# EAGLE design electret-mic-precision-rectifier (EAGLE 6.5.0)
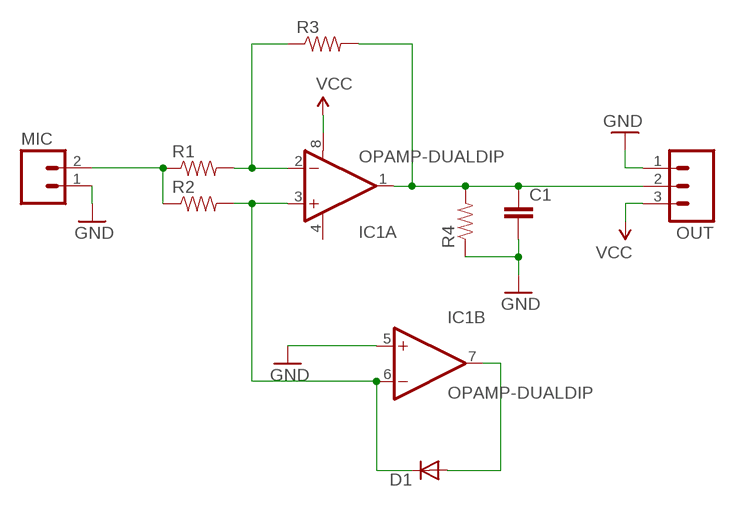
[diagram p0: schematic, sheet 1]

## Parts
C1  CAP_  [AXIAL-5MM]
D1  DIODEPTH  [DIODE-1N4001]
IC1  OPAMP-DUALDIP  [DIP08]
MIC  M02PTH  [1X02]
OUT  M03PTH  [1X03]
R1  RESISTORPTH-1/6W  [1/6W-RES]
R2  RESISTORPTH-1/6W  [1/6W-RES]
R3  RESISTORPTH-1/6W  [1/6W-RES]
R4  RESISTORPTH-1/6W  [1/6W-RES]

## Nets
GND: C1.P$2 IC1.5(B:+IN) MIC.1 OUT.1 R4.1
N$1: C1.P$1 IC1.1(A:OUT) OUT.2 R3.2 R4.2
N$2: IC1.2(A:-IN) R1.2 R3.1
N$4: D1.C IC1.3(A:+IN) IC1.6(B:-IN) R2.2
N$5: D1.A IC1.7(B:OUT)
N$6: MIC.2 R1.1 R2.1
VCC: IC1.8(A:V+) OUT.3

## Power pins joined to a net without a drawn wire
V-: IC1.4(A:V-)

## Library data of the parts
C1 = SparkFun-Capacitors:CAP: Capacitor Standard 0603 ceramic capacitor, and 0.1" leaded capacitor.
D1 = SparkFun-DiscreteSemi:DIODE: Diode These are standard reverse protection diodes and small signal diodes. SMA package can handle up to about 1A. SOD-323 can handle about 200mA. What the SOD-323 package when ordering, there are some mfgs out there that are 5-pin packages.
IC1 = SparkFun-AnalogIC:OPAMP-DUAL: Generic op-amp footprint
MIC = SparkFun-Connectors:M02: Header 2 Standard 2-pin 0.1" header. Use with straight break away headers (SKU : PRT-00116), right angle break away headers (PRT-00553), swiss pins (PRT-00743), machine pins (PRT-00117), and female headers (PRT-00115). Molex polarized connector foot print use with SKU : PRT-08233 with associated crimp pins and housings.
OUT = SparkFun-Connectors:M03: Header 3 Standard 3-pin 0.1" header. Use with straight break away headers (SKU : PRT-00116), right angle break away headers (PRT-00553), swiss pins (PRT-00743), machine pins (PRT-00117), and female headers (PRT-00115). Molex polarized connector foot print use with SKU : PRT-08232 with associated crimp pins and housings.
R1-R4 = SparkFun-Passives:RESISTOR: Resistor Basic schematic elements and footprints for 0603, 1206, and PTH resistors.

## Board
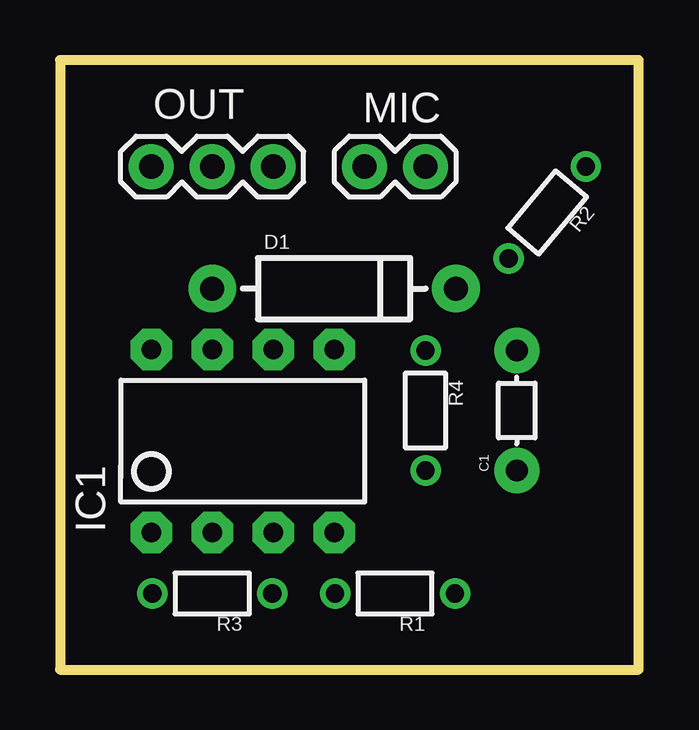
[diagram p1: board, top side]
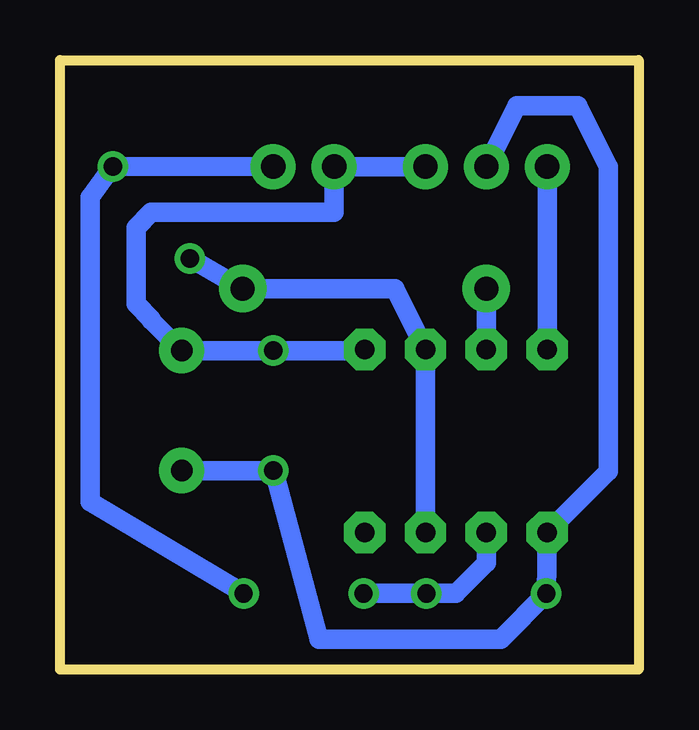
[diagram p2: board, bottom side, seen from below]

Size 24.13 x 25.4 mm. Coordinates in mm from the lower left corner, seen from the top.
Outline: 0,0 24.13,0 24.13,25.4 0,25.4 0,0
Copper layers (1*16): Top 0.035mm / dielectric 1.5mm / Bottom 0.035mm
Design rules "default": minimum track width 10mil, minimum drill 24mil, track to track 8mil, track to pad 8mil, pad to pad 8mil, via to via 8mil, smd to smd 8mil, copper to edge 40mil, drill to drill 8mil, minimum pad ring 10mil, minimum via ring 8mil, stop-mask expansion 4mil, vias tented up to drill 0mil, thermal gap 10mil
Milling: 4 lines

### Footprints (pad centres in the part's own frame; a part is rotated, then mirrored left to right if it is on the bottom)
AXIAL-5MM = drill 0.9 pad 1.88: P$1 -2.5,0; P$2 2.5,0
DIODE-1N4001 = drill 1 pad 1.981: A -5.08,0; C 5.08,0
DIP08 = drill 0.813 pad 1.727 octagon: 1 -3.81,-3.81; 2 -1.27,-3.81; 3 1.27,-3.81; 4 3.81,-3.81; 5 3.81,3.81; 6 1.27,3.81; 7 -1.27,3.81; 8 -3.81,3.81
1X02 = drill 1.016 pad 1.88: 1 0,0; 2 2.54,0
1X03 = drill 1.016 pad 1.88: 1 0,0; 2 2.54,0; 3 5.08,0
1/6W-RES = drill 0.762: 1 -2.5,0; 2 2.5,0

### Placement (x,y rotation side)
C1  19.05,10.79 90 top
D1  11.43,15.88 0 top
IC1  7.62,9.53 0 top
MIC  12.7,20.95 0 top
OUT  8.89,20.95 180 top
R1  13.97,3.17 180 top
R2  20.32,19.05 230 top
R3  6.35,3.17 180 top
R4  15.24,10.79 270 top

### Tracks (layer width: path | path; a pad name or v marks a point on that pad's centre or on a via)
GND
  Bottom 0.813: IC1.5 11.47,13.29 R4.1 C1.P$2 20.32,14.56 20.32,14.61 20.95,15.24 20.95,18.41 20.32,19.05 12.7,19.05 MIC.1 OUT.1
N$1
  Bottom 0.813: C1.P$1 R4.2 15.2,8.26 13.34,1.27 5.75,1.27 R3.2 IC1.1 1.27,8.26 1.27,20.95 2.54,23.5 5.08,23.5 OUT.2
N$2
  Bottom 0.813: IC1.2 6.35,4.45 7.62,3.17 R3.1 R1.2
N$4
  Bottom 0.813: R2.2 D1.C 10.16,15.88 IC1.6 IC1.3
N$5
  Bottom 0.813: D1.A IC1.7
N$6
  Bottom 0.813: MIC.2 R2.1 22.86,19.68 22.86,6.99 R1.1
VCC
  Bottom 0.813: IC1.8 OUT.3